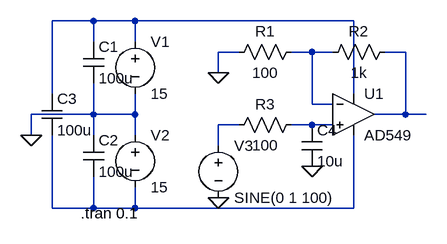
[diagram p0: schematic NonInvertingOpamp.asc]
NonInvertingOpamp.asc, the LTspice schematic file:
Version 4
SHEET 1 880 680
WIRE -64 -64 -128 -64
WIRE 0 -64 -64 -64
WIRE 336 -64 0 -64
WIRE -64 -32 -64 -64
WIRE 0 -32 0 -64
WIRE 160 -16 128 -16
WIRE 272 -16 240 -16
WIRE 304 -16 272 -16
WIRE 416 -16 384 -16
WIRE 128 16 128 -16
WIRE -128 48 -128 -64
WIRE 336 48 336 -64
WIRE 272 64 272 -16
WIRE 304 64 272 64
WIRE -64 80 -64 32
WIRE -64 80 -160 80
WIRE 0 80 0 48
WIRE 0 80 -64 80
WIRE 416 80 416 -16
WIRE 416 80 368 80
WIRE 448 80 416 80
WIRE 160 96 128 96
WIRE 272 96 240 96
WIRE 304 96 272 96
WIRE -160 112 -160 80
WIRE -64 112 -64 80
WIRE 0 112 0 80
WIRE 128 128 128 96
WIRE -128 224 -128 112
WIRE -64 224 -64 176
WIRE -64 224 -128 224
WIRE 0 224 0 192
WIRE 0 224 -64 224
WIRE 336 224 336 112
WIRE 336 224 0 224
FLAG 128 16 0
FLAG 128 208 0
FLAG -160 112 0
FLAG 272 160 0
SYMBOL voltage 0 -48 R0
WINDOW 123 0 0 Left 0
WINDOW 39 0 0 Left 0
SYMATTR InstName V1
SYMATTR Value 15
SYMBOL voltage 0 96 R0
WINDOW 123 0 0 Left 0
WINDOW 39 0 0 Left 0
SYMATTR InstName V2
SYMATTR Value 15
SYMBOL voltage 128 112 R0
WINDOW 123 0 0 Left 0
WINDOW 39 0 0 Left 0
SYMATTR InstName V3
SYMATTR Value SINE(0 1 100)
SYMBOL Opamps\\AD549 336 16 R0
SYMATTR InstName U1
SYMBOL res 256 -32 R90
WINDOW 0 0 56 VBottom 2
WINDOW 3 32 56 VTop 2
SYMATTR InstName R1
SYMATTR Value 100
SYMBOL res 400 -32 R90
WINDOW 0 0 56 VBottom 2
WINDOW 3 32 56 VTop 2
SYMATTR InstName R2
SYMATTR Value 1k
SYMBOL cap -80 -32 R0
SYMATTR InstName C1
SYMATTR Value 100u
SYMBOL cap -80 112 R0
SYMATTR InstName C2
SYMATTR Value 100u
SYMBOL cap -144 48 R0
SYMATTR InstName C3
SYMATTR Value 100u
SYMBOL res 256 80 R90
WINDOW 0 0 56 VBottom 2
WINDOW 3 32 56 VTop 2
SYMATTR InstName R3
SYMATTR Value 100
SYMBOL cap 256 96 R0
SYMATTR InstName C4
SYMATTR Value 10u
TEXT -84 232 Left 2 !.tran 0.1

The netlist it stands for:
* NonInvertingOpamp.asc
V1 N001 0 15
V2 0 N006 15
V3 N004 0 SINE(0 1 100)
XU1 N005 N002 N001 N006 N003 AD549  ; pins In+ In- V+ V- OUT
R1 N002 0 100
R2 N003 N002 1k
C1 N001 0 100u
C2 0 N006 100u
C3 N001 N006 100u
R3 N005 N004 100
C4 N005 0 10u
.tran 0.1
.backanno
.end